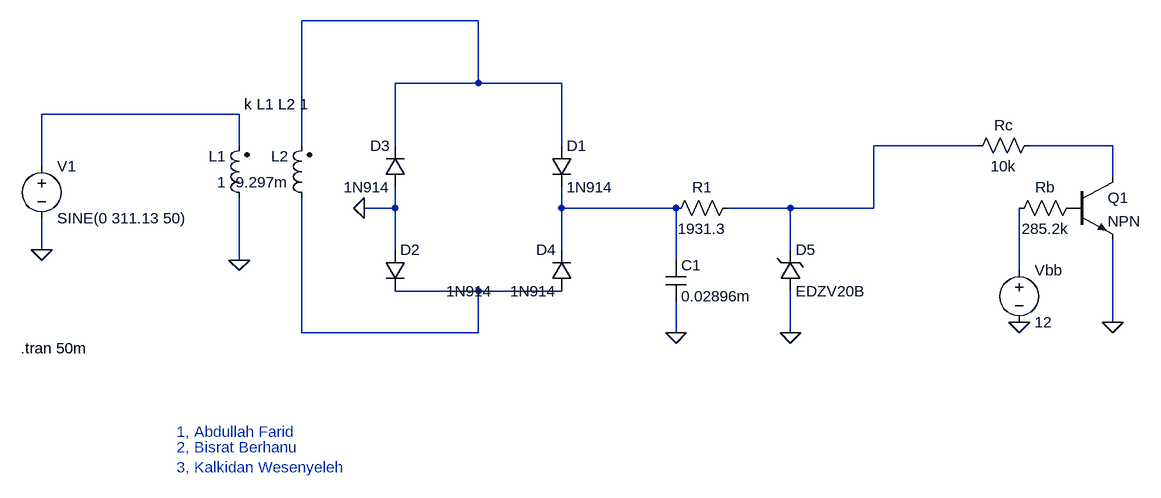
[diagram p0: schematic Simulation.asc]
Simulation.asc, the LTspice schematic file:
Version 4
SHEET 1 1600 680
WIRE 528 -320 256 -320
WIRE 528 -224 528 -320
WIRE 528 -224 400 -224
WIRE 656 -224 528 -224
WIRE 160 -176 -144 -176
WIRE 160 -128 160 -176
WIRE 256 -128 256 -320
WIRE 400 -128 400 -224
WIRE 656 -128 656 -224
WIRE 1296 -128 1136 -128
WIRE 1504 -128 1376 -128
WIRE -144 -96 -144 -176
WIRE 1504 -80 1504 -128
WIRE 400 -32 400 -64
WIRE 400 -32 352 -32
WIRE 656 -32 656 -64
WIRE 832 -32 656 -32
WIRE 1008 -32 912 -32
WIRE 1136 -32 1136 -128
WIRE 1136 -32 1008 -32
WIRE -144 32 -144 -16
WIRE 400 32 400 -32
WIRE 656 32 656 -32
WIRE 1008 32 1008 -32
WIRE 160 48 160 -48
WIRE 832 48 832 -32
WIRE 1360 64 1360 -32
WIRE 528 96 400 96
WIRE 656 96 528 96
WIRE 1504 144 1504 16
WIRE 256 160 256 -48
WIRE 528 160 528 96
WIRE 528 160 256 160
WIRE 832 160 832 112
WIRE 1008 160 1008 96
FLAG -144 32 0
FLAG 160 48 0
FLAG 352 -32 0
FLAG 832 160 0
FLAG 1008 160 0
FLAG 1360 144 0
FLAG 1504 144 0
SYMBOL voltage -144 -112 R0
WINDOW 123 0 0 Left 0
WINDOW 39 0 0 Left 0
SYMATTR InstName V1
SYMATTR Value SINE(0 311.13 50)
SYMBOL diode 384 32 R0
WINDOW 3 166 64 Right 2
SYMATTR Value 1N914
SYMATTR InstName D2
SYMBOL diode 672 96 R180
WINDOW 0 24 64 Left 2
WINDOW 3 24 0 Left 2
SYMATTR InstName D4
SYMATTR Value 1N914
SYMBOL diode 640 -128 R0
SYMATTR InstName D1
SYMATTR Value 1N914
SYMBOL diode 416 -64 R180
WINDOW 0 24 64 Left 2
WINDOW 3 24 0 Left 2
SYMATTR InstName D3
SYMATTR Value 1N914
SYMBOL cap 816 48 R0
SYMATTR InstName C1
SYMATTR Value 0.02896m
SYMBOL res 816 -16 R270
WINDOW 0 32 56 VTop 2
WINDOW 3 0 56 VBottom 2
SYMATTR InstName R1
SYMATTR Value 1931.3
SYMBOL zener 992 96 M180
WINDOW 0 24 64 Left 2
WINDOW 3 24 0 Left 2
SYMATTR InstName D5
SYMATTR Value EDZV20B
SYMBOL npn 1440 -80 R0
SYMATTR InstName Q1
SYMBOL res 1280 -112 R270
WINDOW 0 32 56 VTop 2
WINDOW 3 0 56 VBottom 2
SYMATTR InstName Rc
SYMATTR Value 10k
SYMBOL res 1456 -48 R90
WINDOW 0 0 56 VBottom 2
WINDOW 3 32 56 VTop 2
SYMATTR InstName Rb
SYMATTR Value 285.2k
SYMBOL voltage 1360 48 R0
WINDOW 123 0 0 Left 0
WINDOW 39 0 0 Left 0
SYMATTR InstName Vbb
SYMATTR Value 12
SYMBOL ind2 176 -32 R180
WINDOW 0 36 80 Left 2
WINDOW 3 36 40 Left 2
SYMATTR InstName L1
SYMATTR Value 1
SYMATTR Type ind
SYMATTR SpiceLine Rser=0.001m
SYMBOL ind2 272 -32 R180
WINDOW 0 36 80 Left 2
WINDOW 3 36 40 Left 2
SYMATTR InstName L2
SYMATTR Value 9.297m
SYMATTR Type ind
TEXT 168 -192 Left 2 !k L1 L2 1
TEXT -176 184 Left 2 !.tran 50m
TEXT 64 312 Left 2 ;1, Abdullah Farid
TEXT 64 336 Left 2 ;2, Bisrat Berhanu\n3, Kalkidan Wesenyeleh

The netlist it stands for:
* Simulation.asc
V1 N002 0 SINE(0 311.13 50)
D2 0 N007 1N914
D4 N007 N005 1N914
D1 N001 N005 1N914
D3 0 N001 1N914
C1 N005 0 0.02896m
R1 N005 N003 1931.3
D5 0 N003 EDZV20B
Q1 N004 P001 0 0 NPN
Rc N003 N004 10k
Rb P001 N006 285.2k
Vbb N006 0 12
L1 0 N002 1 Rser=0.001m
L2 N007 N001 9.297m
.model D D
.lib standard.dio
.model NPN NPN
.model PNP PNP
.lib standard.bjt
k L1 L2 1
.tran 50m
* 1, Abdullah Farid
* 2, Bisrat Berhanu
* 3, Kalkidan Wesenyeleh
.backanno
.end